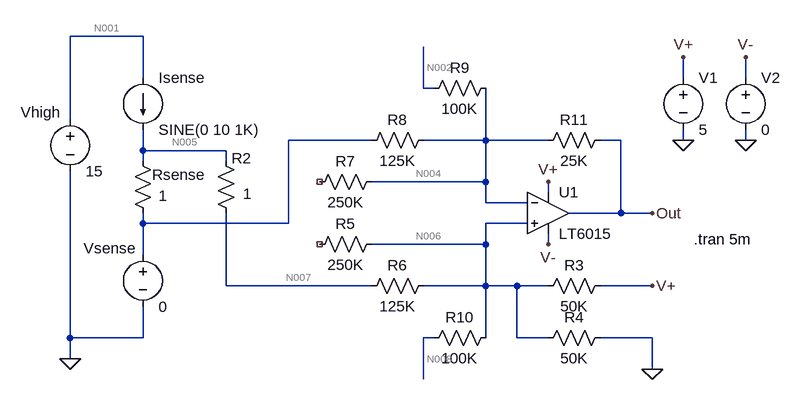
[diagram p0: schematic SpiderAmp20ppVto4ppV.asc]
SpiderAmp20ppVto4ppV.asc, the LTspice schematic file:
Version 4
SHEET 1 1092 680
WIRE 96 -80 -16 -80
WIRE 96 -16 96 -80
WIRE 928 -16 928 -48
WIRE 1024 -16 1024 -48
WIRE 528 0 528 -64
WIRE 544 0 528 0
WIRE -16 48 -16 -80
WIRE 448 80 320 80
WIRE 624 80 624 0
WIRE 624 80 528 80
WIRE 720 80 624 80
WIRE 832 80 800 80
WIRE 928 80 928 64
WIRE 1024 80 1024 64
WIRE 96 96 96 64
WIRE 224 96 96 96
WIRE 96 112 96 96
WIRE 224 112 224 96
WIRE 624 144 624 80
WIRE 624 144 448 144
WIRE 720 160 720 144
WIRE 624 176 624 144
WIRE 688 176 624 176
WIRE 832 192 832 80
WIRE 832 192 752 192
WIRE 880 192 832 192
WIRE 96 208 96 192
WIRE 320 208 320 80
WIRE 320 208 96 208
WIRE 688 208 624 208
WIRE 624 240 624 208
WIRE 624 240 448 240
WIRE 720 240 720 224
WIRE 96 256 96 208
WIRE 224 304 224 192
WIRE 448 304 224 304
WIRE 624 304 624 240
WIRE 624 304 528 304
WIRE 672 304 624 304
WIRE 720 304 672 304
WIRE 880 304 800 304
WIRE -16 384 -16 128
WIRE 96 384 96 336
WIRE 96 384 -16 384
WIRE 544 384 528 384
WIRE 624 384 624 304
WIRE 672 384 672 304
WIRE 720 384 672 384
WIRE 880 384 800 384
WIRE -16 416 -16 384
WIRE 880 432 880 384
WIRE 528 448 528 384
FLAG 720 144 V+
FLAG 720 240 V-
FLAG 880 192 Out
FLAG 928 80 0
FLAG 1024 80 0
FLAG 928 -48 V+
FLAG 1024 -48 V-
FLAG -16 416 0
FLAG 880 432 0
FLAG 880 304 V+
SYMBOL Opamps\\LT6015 720 192 R0
SYMATTR InstName U1
SYMBOL res 464 224 R90
WINDOW 0 0 56 VBottom 2
WINDOW 3 32 56 VTop 2
SYMATTR InstName R5
SYMATTR Value 250K
SYMBOL res 544 288 R90
WINDOW 0 0 56 VBottom 2
WINDOW 3 32 56 VTop 2
SYMATTR InstName R6
SYMATTR Value 125K
SYMBOL res 464 128 R90
WINDOW 0 0 56 VBottom 2
WINDOW 3 32 56 VTop 2
SYMATTR InstName R7
SYMATTR Value 250K
SYMBOL res 544 64 R90
WINDOW 0 0 56 VBottom 2
WINDOW 3 32 56 VTop 2
SYMATTR InstName R8
SYMATTR Value 125K
SYMBOL res 640 -16 R90
WINDOW 0 0 56 VBottom 2
WINDOW 3 32 56 VTop 2
SYMATTR InstName R9
SYMATTR Value 100K
SYMBOL res 640 368 R90
WINDOW 0 0 56 VBottom 2
WINDOW 3 32 56 VTop 2
SYMATTR InstName R10
SYMATTR Value 100K
SYMBOL res 816 64 R90
WINDOW 0 0 56 VBottom 2
WINDOW 3 32 56 VTop 2
SYMATTR InstName R11
SYMATTR Value 25K
SYMBOL res 816 288 R90
WINDOW 0 0 56 VBottom 2
WINDOW 3 32 56 VTop 2
SYMATTR InstName R3
SYMATTR Value 50K
SYMBOL res 816 368 R90
WINDOW 0 0 56 VBottom 2
WINDOW 3 32 56 VTop 2
SYMATTR InstName R4
SYMATTR Value 50K
SYMBOL voltage 928 -32 R0
WINDOW 123 0 0 Left 2
WINDOW 39 0 0 Left 2
SYMATTR InstName V1
SYMATTR Value 5
SYMBOL voltage 1024 -32 R0
WINDOW 123 0 0 Left 2
WINDOW 39 0 0 Left 2
SYMATTR InstName V2
SYMATTR Value 0
SYMBOL voltage -16 32 R0
WINDOW 0 -76 5 Left 2
WINDOW 123 0 0 Left 2
WINDOW 39 0 0 Left 2
SYMATTR InstName Vhigh
SYMATTR Value 15
SYMBOL current 96 -16 R0
WINDOW 123 0 0 Left 2
WINDOW 39 0 0 Left 2
SYMATTR InstName Isense
SYMATTR Value SINE(0 10 1K)
SYMBOL res 112 208 R180
WINDOW 0 -80 75 Left 2
WINDOW 3 -22 43 Left 2
SYMATTR InstName Rsense
SYMATTR Value 1
SYMBOL voltage 96 240 R0
WINDOW 0 -91 6 Left 2
WINDOW 123 0 0 Left 2
WINDOW 39 0 0 Left 2
SYMATTR InstName Vsense
SYMATTR Value 0
SYMBOL res 240 208 R180
WINDOW 0 -23 100 Left 2
WINDOW 3 -24 46 Left 2
SYMATTR InstName R2
SYMATTR Value 1
TEXT 944 232 Left 2 !.tran 5m

The netlist it stands for:
* SpiderAmp20ppVto4ppV.asc
XU1 N006 N004 V+ V- Out LT6016  ; LT6015, pins In+ In- V+ V- OUT
R5 N006 NC_01 250K
R6 N006 N007 125K
R7 N004 NC_02 250K
R8 N004 N003 125K
R9 N004 N002 100K
R10 N006 N008 100K
R11 Out N004 25K
R3 V+ N006 50K
R4 0 N006 50K
V1 V+ 0 5
V2 V- 0 0
Vhigh N001 0 15
Isense N001 N005 SINE(0 10 1K)
Rsense N003 N005 1
Vsense N003 0 0
R2 N007 N005 1
.tran 5m
.lib LTC2.lib
.backanno
.end

* Results of the author's LTspice run, read from the files saved beside the schematic
* Operating Point, zero values left out:
*   V(v+) = 5 V
*   V(out) = 2.5 V
*   V(n006) = 2.083 V
*   V(n004) = 2.083 V
*   V(n007) = 33.33 µV
*   V(n002) = 2.083 V
*   V(n008) = 2.083 V
*   V(n001) = 15 V
*   V(n005) = 16.67 µV
*   I(R2) = 16.67 µA
*   I(Rsense) = -16.67 µA
*   I(R4) = -41.67 µA
*   I(R3) = 58.33 µA
*   I(R11) = 16.67 µA
*   I(R8) = 16.67 µA
*   I(R6) = 16.67 µA
*   I(Vsense) = 33.33 µA
*   I(V2) = 312.6 µA
*   I(V1) = -387.6 µA
*   Ix(u1:1) = 926.1 pA
*   Ix(u1:2) = 926 pA
*   Ix(u1:3) = 329.3 µA
*   Ix(u1:4) = -312.6 µA
*   Ix(u1:5) = -16.67 µA